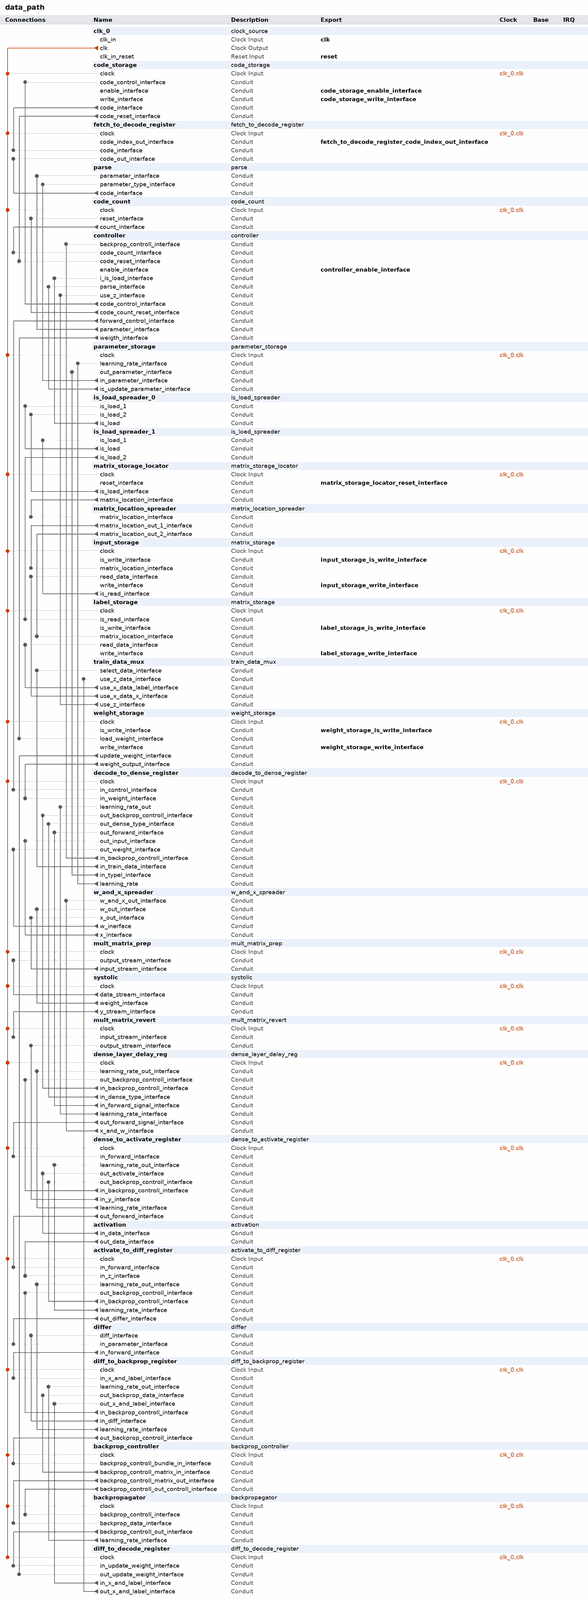
[diagram p0: system contents, whole]
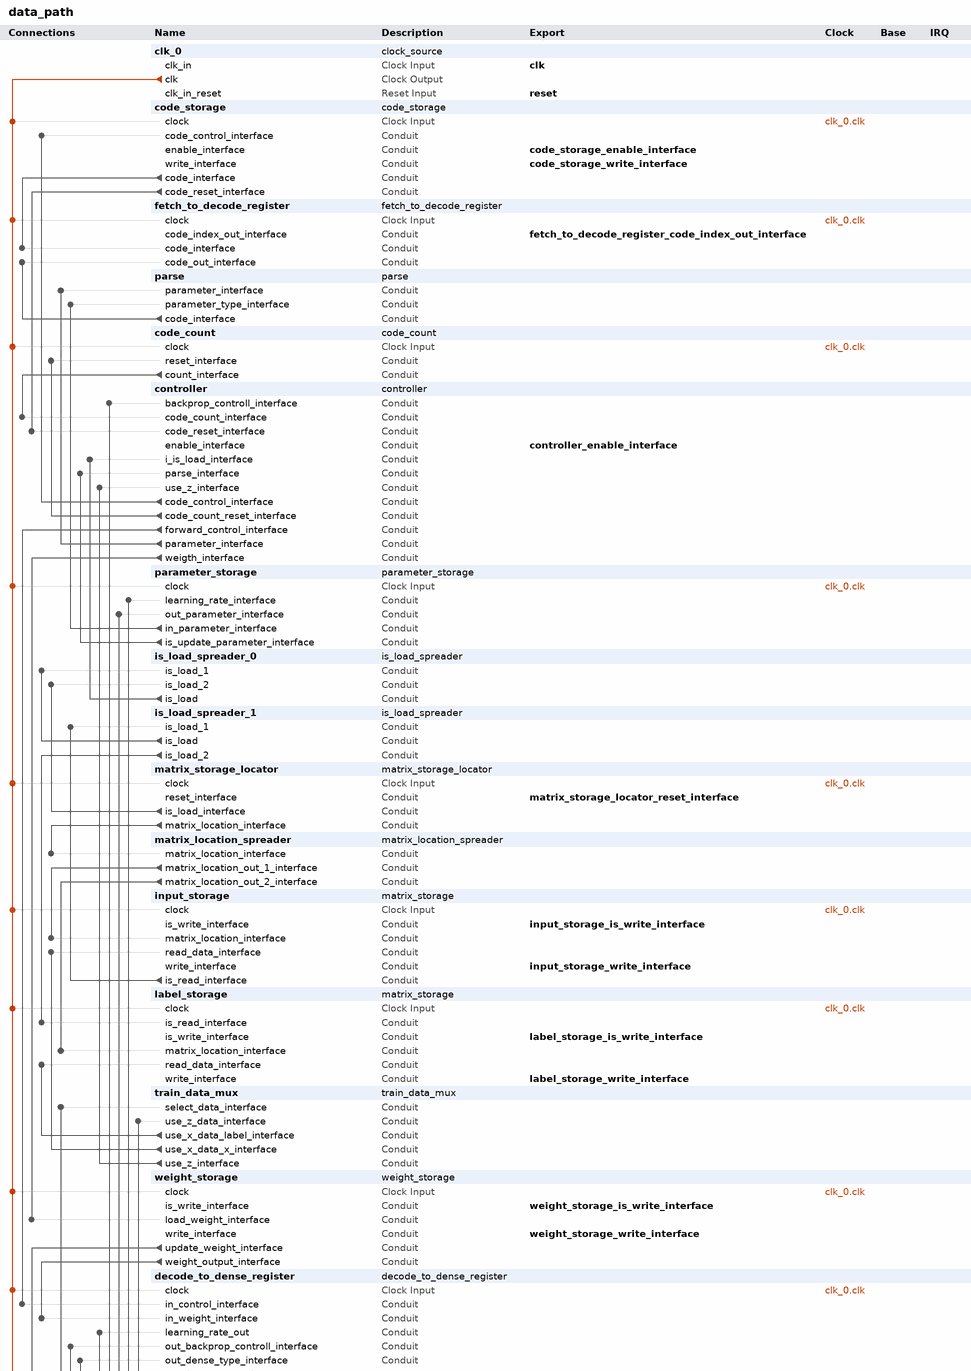
[diagram p1: system contents, upper part]
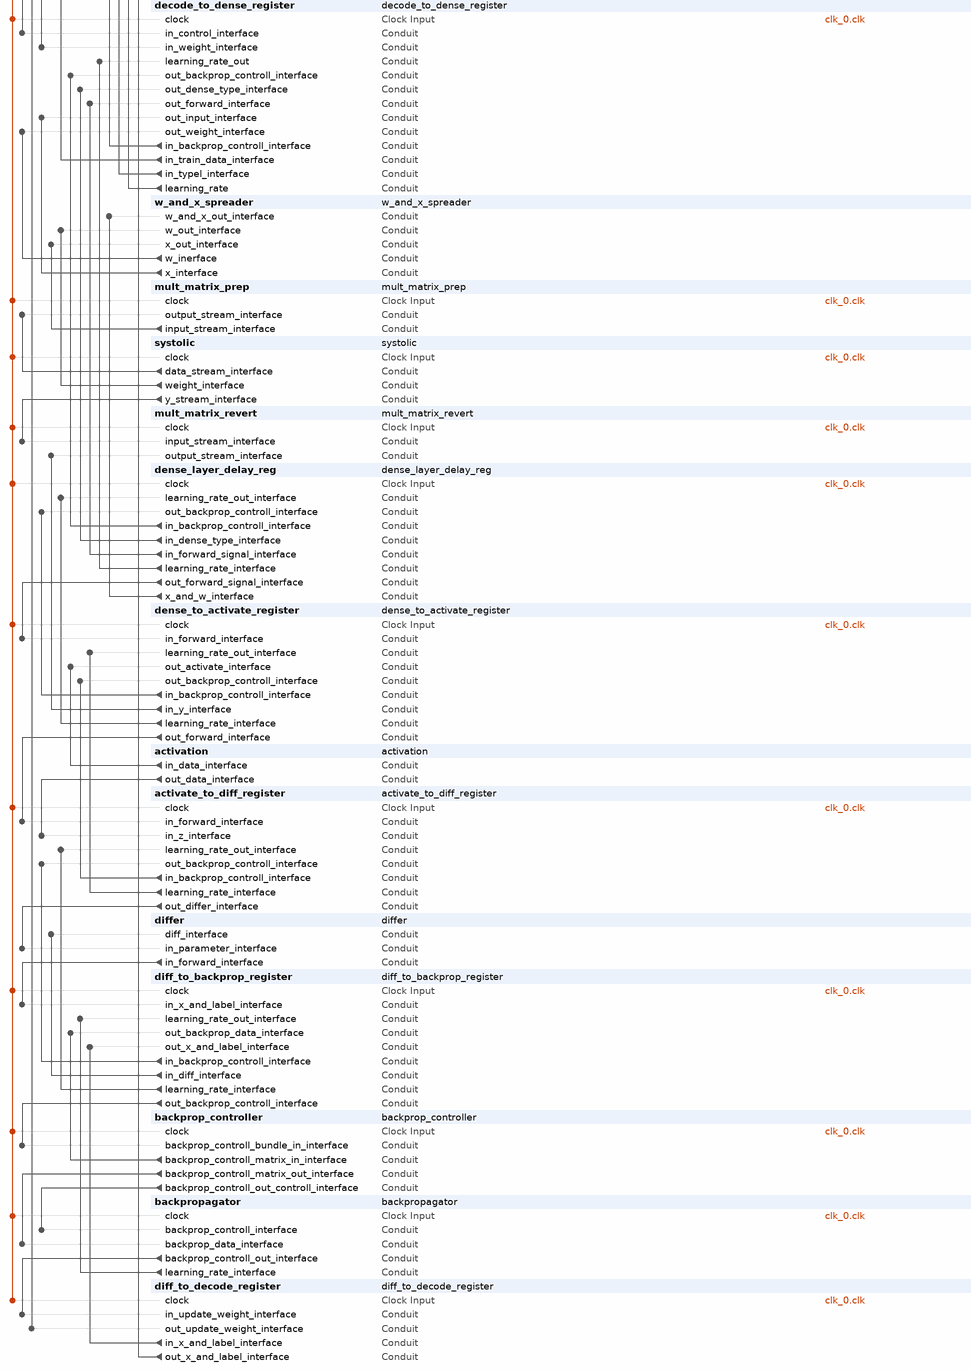
[diagram p2: system contents, lower part]
# Platform Designer (Qsys) system data_path, Cyclone V 5CSEMA5F31C6
# Parameters at their usual value, and those the tool derives, are not listed.
package require -exact qsys 20.1
create_system data_path
set_project_property DEVICE_FAMILY {Cyclone V}
set_project_property DEVICE 5CSEMA5F31C6

add_instance clk_0 clock_source 20.1
set_instance_parameter_value clk_0 clockFrequency 50000000

add_instance code_storage code_storage 1.0
set_instance_parameter_value code_storage code_size 12
set_instance_parameter_value code_storage max_code_line 100

add_instance fetch_to_decode_register fetch_to_decode_register 1.0
set_instance_parameter_value fetch_to_decode_register code_size 12

add_instance parse parse 1.0
set_instance_parameter_value parse data_size 16
set_instance_parameter_value parse op_size 4
set_instance_parameter_value parse param_a_size 4
set_instance_parameter_value parse param_b_size 4

add_instance code_count code_count 1.0

add_instance controller controller 1.0
set_instance_parameter_value controller backprop_controll_size 66
set_instance_parameter_value controller op_size 4
set_instance_parameter_value controller param_a_size 4
set_instance_parameter_value controller param_b_size 4
set_instance_parameter_value controller size 3

add_instance parameter_storage parameter_storage 1.0
set_instance_parameter_value parameter_storage act_type_size 4
set_instance_parameter_value parameter_storage cost_type_size 8
set_instance_parameter_value parameter_storage dense_type_size 4
set_instance_parameter_value parameter_storage learning_rate_size 16

add_instance is_load_spreader_0 is_load_spreader 1.0
set_instance_parameter_value is_load_spreader_0 size 1

add_instance is_load_spreader_1 is_load_spreader 1.0
set_instance_parameter_value is_load_spreader_1 size 1

add_instance matrix_storage_locator matrix_storage_locator 1.0
set_instance_parameter_value matrix_storage_locator size 3

add_instance matrix_location_spreader matrix_location_spreader 1.0
set_instance_parameter_value matrix_location_spreader layer_index_size 32
set_instance_parameter_value matrix_location_spreader row_index_size 32

add_instance input_storage matrix_storage 1.0
set_instance_parameter_value input_storage data_size 16
set_instance_parameter_value input_storage max_layer 5
set_instance_parameter_value input_storage size 3

add_instance label_storage matrix_storage 1.0
set_instance_parameter_value label_storage data_size 16
set_instance_parameter_value label_storage max_layer 5
set_instance_parameter_value label_storage size 3

add_instance train_data_mux train_data_mux 1.0
set_instance_parameter_value train_data_mux data_size 16
set_instance_parameter_value train_data_mux size 3

add_instance weight_storage weight_storage 1.0
set_instance_parameter_value weight_storage data_size 16
set_instance_parameter_value weight_storage layer_size 5
set_instance_parameter_value weight_storage size 3

add_instance decode_to_dense_register decode_to_dense_register 1.0
set_instance_parameter_value decode_to_dense_register act_type_size 4
set_instance_parameter_value decode_to_dense_register backprop_controll_size 66
set_instance_parameter_value decode_to_dense_register cost_type_size 8
set_instance_parameter_value decode_to_dense_register data_size 16
set_instance_parameter_value decode_to_dense_register dense_type_size 4
set_instance_parameter_value decode_to_dense_register learning_rate_size 16
set_instance_parameter_value decode_to_dense_register size 3

add_instance w_and_x_spreader w_and_x_spreader 1.0
set_instance_parameter_value w_and_x_spreader data_size 16
set_instance_parameter_value w_and_x_spreader size 3

add_instance mult_matrix_prep mult_matrix_prep 1.0
set_instance_parameter_value mult_matrix_prep data_size 16
set_instance_parameter_value mult_matrix_prep size 3

add_instance systolic systolic 1.0
set_instance_parameter_value systolic data_size 16
set_instance_parameter_value systolic size 3

add_instance mult_matrix_revert mult_matrix_revert 1.0
set_instance_parameter_value mult_matrix_revert data_size 16
set_instance_parameter_value mult_matrix_revert size 3

add_instance dense_layer_delay_reg dense_layer_delay_reg 1.0
set_instance_parameter_value dense_layer_delay_reg act_type_size 4
set_instance_parameter_value dense_layer_delay_reg backprop_controll_size 66
set_instance_parameter_value dense_layer_delay_reg cost_type_size 8
set_instance_parameter_value dense_layer_delay_reg data_size 16
set_instance_parameter_value dense_layer_delay_reg dense_type_size 4
set_instance_parameter_value dense_layer_delay_reg learning_rate_size 16
set_instance_parameter_value dense_layer_delay_reg size 3

add_instance dense_to_activate_register dense_to_activate_register 1.0
set_instance_parameter_value dense_to_activate_register act_type_size 4
set_instance_parameter_value dense_to_activate_register backprop_controll_size 66
set_instance_parameter_value dense_to_activate_register cost_type_size 8
set_instance_parameter_value dense_to_activate_register data_size 16
set_instance_parameter_value dense_to_activate_register dense_type_size 4
set_instance_parameter_value dense_to_activate_register learning_rate_size 16
set_instance_parameter_value dense_to_activate_register size 3

add_instance activation activation 1.0
set_instance_parameter_value activation activate_size 4
set_instance_parameter_value activation data_size 16
set_instance_parameter_value activation size 3

add_instance activate_to_diff_register activate_to_diff_register 1.0
set_instance_parameter_value activate_to_diff_register act_type_size 4
set_instance_parameter_value activate_to_diff_register backprop_controll_size 66
set_instance_parameter_value activate_to_diff_register cost_type_size 8
set_instance_parameter_value activate_to_diff_register data_size 16
set_instance_parameter_value activate_to_diff_register dense_type_size 4
set_instance_parameter_value activate_to_diff_register learning_rate_size 16
set_instance_parameter_value activate_to_diff_register size 3

add_instance differ differ 1.0
set_instance_parameter_value differ act_type_size 4
set_instance_parameter_value differ cost_type_size 8
set_instance_parameter_value differ data_size 16
set_instance_parameter_value differ dense_type_size 4
set_instance_parameter_value differ size 3

add_instance diff_to_backprop_register diff_to_backprop_register 1.0
set_instance_parameter_value diff_to_backprop_register backprop_controll_size 66
set_instance_parameter_value diff_to_backprop_register data_size 16
set_instance_parameter_value diff_to_backprop_register dense_type_size 4
set_instance_parameter_value diff_to_backprop_register learning_rate_size 16
set_instance_parameter_value diff_to_backprop_register size 3

add_instance backprop_controller backprop_controller 1.0
set_instance_parameter_value backprop_controller backprop_controll_size 66
set_instance_parameter_value backprop_controller data_size 16
set_instance_parameter_value backprop_controller max_layer_size 4
set_instance_parameter_value backprop_controller size 3

add_instance backpropagator backpropagator 1.0
set_instance_parameter_value backpropagator data_size 16
set_instance_parameter_value backpropagator learning_rate_size 16
set_instance_parameter_value backpropagator max_layer_size 10
set_instance_parameter_value backpropagator size 3

add_instance diff_to_decode_register diff_to_decode_register 1.0
set_instance_parameter_value diff_to_decode_register data_size 16
set_instance_parameter_value diff_to_decode_register size 3

# connections
add_connection clk_0.clk activate_to_diff_register.clock clock
add_connection clk_0.clk backprop_controller.clock clock
add_connection clk_0.clk backpropagator.clock clock
add_connection clk_0.clk code_count.clock clock
add_connection clk_0.clk code_storage.clock clock
add_connection clk_0.clk decode_to_dense_register.clock clock
add_connection clk_0.clk dense_layer_delay_reg.clock clock
add_connection clk_0.clk dense_to_activate_register.clock clock
add_connection clk_0.clk diff_to_backprop_register.clock clock
add_connection clk_0.clk diff_to_decode_register.clock clock
add_connection clk_0.clk fetch_to_decode_register.clock clock
add_connection clk_0.clk input_storage.clock clock
add_connection clk_0.clk label_storage.clock clock
add_connection clk_0.clk matrix_storage_locator.clock clock
add_connection clk_0.clk mult_matrix_prep.clock clock
add_connection clk_0.clk mult_matrix_revert.clock clock
add_connection clk_0.clk parameter_storage.clock clock
add_connection clk_0.clk systolic.clock clock
add_connection clk_0.clk weight_storage.clock clock
add_connection activate_to_diff_register.in_backprop_controll_interface dense_to_activate_register.out_backprop_controll_interface conduit
add_connection activate_to_diff_register.learning_rate_interface dense_to_activate_register.learning_rate_out_interface conduit
add_connection activate_to_diff_register.out_differ_interface differ.in_parameter_interface conduit
add_connection activation.in_data_interface dense_to_activate_register.out_activate_interface conduit
add_connection activation.out_data_interface activate_to_diff_register.in_z_interface conduit
add_connection backprop_controller.backprop_controll_matrix_in_interface diff_to_backprop_register.out_backprop_data_interface conduit
add_connection backprop_controller.backprop_controll_matrix_out_interface backpropagator.backprop_data_interface conduit
add_connection backprop_controller.backprop_controll_out_controll_interface backpropagator.backprop_controll_interface conduit
add_connection backpropagator.backprop_controll_out_interface diff_to_decode_register.in_update_weight_interface conduit
add_connection backpropagator.learning_rate_interface diff_to_backprop_register.learning_rate_out_interface conduit
add_connection code_count.count_interface controller.code_count_interface conduit
add_connection code_storage.code_interface fetch_to_decode_register.code_interface conduit
add_connection code_storage.code_reset_interface controller.code_reset_interface conduit
add_connection controller.code_control_interface code_storage.code_control_interface conduit
add_connection controller.code_count_reset_interface code_count.reset_interface conduit
add_connection controller.forward_control_interface decode_to_dense_register.in_control_interface conduit
add_connection controller.parameter_interface parse.parameter_interface conduit
add_connection controller.weigth_interface weight_storage.load_weight_interface conduit
add_connection decode_to_dense_register.in_backprop_controll_interface controller.backprop_controll_interface conduit
add_connection decode_to_dense_register.in_train_data_interface train_data_mux.select_data_interface conduit
add_connection decode_to_dense_register.in_typel_interface parameter_storage.out_parameter_interface conduit
add_connection decode_to_dense_register.learning_rate parameter_storage.learning_rate_interface conduit
add_connection dense_layer_delay_reg.in_backprop_controll_interface decode_to_dense_register.out_backprop_controll_interface conduit
add_connection dense_layer_delay_reg.in_dense_type_interface decode_to_dense_register.out_dense_type_interface conduit
add_connection dense_layer_delay_reg.in_forward_signal_interface decode_to_dense_register.out_forward_interface conduit
add_connection dense_layer_delay_reg.learning_rate_interface decode_to_dense_register.learning_rate_out conduit
add_connection dense_layer_delay_reg.out_forward_signal_interface dense_to_activate_register.in_forward_interface conduit
add_connection dense_layer_delay_reg.x_and_w_interface w_and_x_spreader.w_and_x_out_interface conduit
add_connection dense_to_activate_register.in_backprop_controll_interface dense_layer_delay_reg.out_backprop_controll_interface conduit
add_connection dense_to_activate_register.in_y_interface mult_matrix_revert.output_stream_interface conduit
add_connection dense_to_activate_register.learning_rate_interface dense_layer_delay_reg.learning_rate_out_interface conduit
add_connection dense_to_activate_register.out_forward_interface activate_to_diff_register.in_forward_interface conduit
add_connection diff_to_backprop_register.in_backprop_controll_interface activate_to_diff_register.out_backprop_controll_interface conduit
add_connection diff_to_backprop_register.in_diff_interface differ.diff_interface conduit
add_connection diff_to_backprop_register.learning_rate_interface activate_to_diff_register.learning_rate_out_interface conduit
add_connection diff_to_backprop_register.out_backprop_controll_interface backprop_controller.backprop_controll_bundle_in_interface conduit
add_connection diff_to_decode_register.in_x_and_label_interface diff_to_backprop_register.out_x_and_label_interface conduit
add_connection diff_to_decode_register.out_x_and_label_interface train_data_mux.use_z_data_interface conduit
add_connection differ.in_forward_interface diff_to_backprop_register.in_x_and_label_interface conduit
add_connection input_storage.is_read_interface is_load_spreader_1.is_load_1 conduit
add_connection is_load_spreader_0.is_load controller.i_is_load_interface conduit
add_connection is_load_spreader_1.is_load is_load_spreader_0.is_load_1 conduit
add_connection is_load_spreader_1.is_load_2 label_storage.is_read_interface conduit
add_connection matrix_location_spreader.matrix_location_out_1_interface input_storage.matrix_location_interface conduit
add_connection matrix_location_spreader.matrix_location_out_2_interface label_storage.matrix_location_interface conduit
add_connection matrix_storage_locator.is_load_interface is_load_spreader_0.is_load_2 conduit
add_connection matrix_storage_locator.matrix_location_interface matrix_location_spreader.matrix_location_interface conduit
add_connection mult_matrix_prep.input_stream_interface w_and_x_spreader.x_out_interface conduit
add_connection parameter_storage.in_parameter_interface parse.parameter_type_interface conduit
add_connection parameter_storage.is_update_parameter_interface controller.parse_interface conduit
add_connection parse.code_interface fetch_to_decode_register.code_out_interface conduit
add_connection systolic.data_stream_interface mult_matrix_prep.output_stream_interface conduit
add_connection systolic.weight_interface w_and_x_spreader.w_out_interface conduit
add_connection systolic.y_stream_interface mult_matrix_revert.input_stream_interface conduit
add_connection train_data_mux.use_x_data_label_interface label_storage.read_data_interface conduit
add_connection train_data_mux.use_x_data_x_interface input_storage.read_data_interface conduit
add_connection train_data_mux.use_z_interface controller.use_z_interface conduit
add_connection w_and_x_spreader.w_inerface decode_to_dense_register.out_weight_interface conduit
add_connection w_and_x_spreader.x_interface decode_to_dense_register.out_input_interface conduit
add_connection weight_storage.update_weight_interface diff_to_decode_register.out_update_weight_interface conduit
add_connection weight_storage.weight_output_interface decode_to_dense_register.in_weight_interface conduit

# exported interfaces
add_interface clk clock sink
set_interface_property clk EXPORT_OF clk_0.clk_in
add_interface code_storage_enable_interface conduit end
set_interface_property code_storage_enable_interface EXPORT_OF code_storage.enable_interface
add_interface code_storage_write_interface conduit end
set_interface_property code_storage_write_interface EXPORT_OF code_storage.write_interface
add_interface controller_enable_interface conduit end
set_interface_property controller_enable_interface EXPORT_OF controller.enable_interface
add_interface fetch_to_decode_register_code_index_out_interface conduit end
set_interface_property fetch_to_decode_register_code_index_out_interface EXPORT_OF fetch_to_decode_register.code_index_out_interface
add_interface input_storage_is_write_interface conduit end
set_interface_property input_storage_is_write_interface EXPORT_OF input_storage.is_write_interface
add_interface input_storage_write_interface conduit end
set_interface_property input_storage_write_interface EXPORT_OF input_storage.write_interface
add_interface label_storage_is_write_interface conduit end
set_interface_property label_storage_is_write_interface EXPORT_OF label_storage.is_write_interface
add_interface label_storage_write_interface conduit end
set_interface_property label_storage_write_interface EXPORT_OF label_storage.write_interface
add_interface matrix_storage_locator_reset_interface conduit end
set_interface_property matrix_storage_locator_reset_interface EXPORT_OF matrix_storage_locator.reset_interface
add_interface reset reset sink
set_interface_property reset EXPORT_OF clk_0.clk_in_reset
add_interface weight_storage_is_write_interface conduit end
set_interface_property weight_storage_is_write_interface EXPORT_OF weight_storage.is_write_interface
add_interface weight_storage_write_interface conduit end
set_interface_property weight_storage_write_interface EXPORT_OF weight_storage.write_interface

set_interconnect_requirement {$system} qsys_mm.clockCrossingAdapter HANDSHAKE
set_interconnect_requirement {$system} qsys_mm.enableEccProtection FALSE
set_interconnect_requirement {$system} qsys_mm.insertDefaultSlave FALSE
set_interconnect_requirement {$system} qsys_mm.maxAdditionalLatency 1

save_system data_path.qsys
